# Altium project Labortápegység_v1.PrjPcb
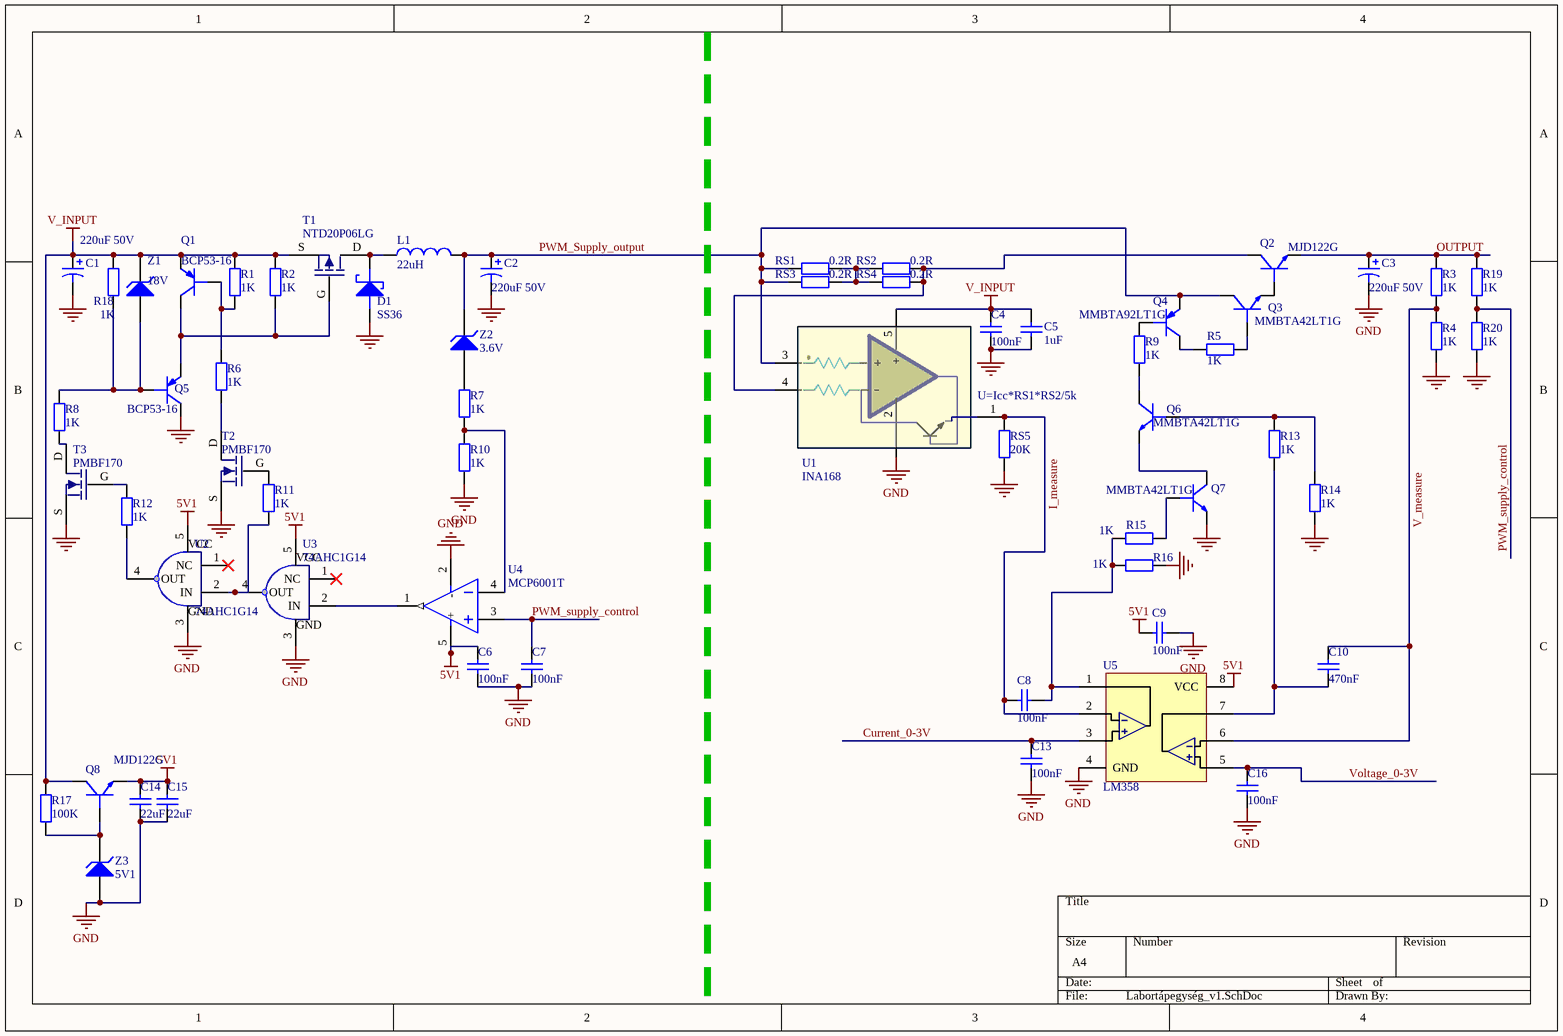
[diagram p0: Labortápegység_v1.SchDoc]
1 sheet, 60 parts. Net scope: global (net labels, ports and power ports of the same name join across sheets).
Board file: Labortápegység_v1.PcbDoc

## Sheet Labortápegység_v1.SchDoc
size A4; PageSetup: Record=PageOptions|CenterHorizontal=True|CenterVertical=True|PrintScale=0.96|XCorrection=1.00|YCorrection=1.00|PrintKind=2|BorderSize=5000000|LeftOffset=0|BottomOffset=0|Orientation=2|PaperLength=1000|PaperWidth=1000|Scale=100|PaperSource=7|PrintQuality=-4|MediaType=1|DitherType=10|PaperKind=A4|PrintScaleMode=1

### Parts
C1  220uF 50V  [CAP_ALU_ELKO_10D_10,5H]
C2  220uF 50V  [CAP_ALU_ELKO_10D_10,5H]
C3  220uF 50V  [CAP_ALU_ELKO_10D_10,5H]
C4  100nF  [FP_0603_CAP_080]
C5  1uF  [FP_0603_CAP_080]
C6  100nF  [FP_0603_CAP_080]
C7  100nF  [FP_0603_CAP_080]
C8  100nF  [FP_0603_CAP_080]
C9  100nF  [FP_0603_CAP_080]
C10  470nF  [FP_0603_CAP_080]
C13  100nF  [FP_0603_CAP_080]
C14  22uF  [FP_1210_CAP_N]
C15  22uF  [FP_1210_CAP_N]
C16  100nF  [FP_0603_CAP_080]
D1  SS36  [DIODE_SMC]
L1  22uH  [SRR1206_T]
Q1  BCP53-16  [TR_SOT223]
Q2  MJD122G  [TR_D-PAK]
Q3  MMBTA42LT1G  [TR_SOT23]
Q4  MMBTA92LT1G  [TR_SOT23]
Q5  BCP53-16  [TR_SOT223]
Q6  MMBTA42LT1G  [TR_SOT23]
Q7  MMBTA42LT1G  [TR_SOT23]
Q8  MJD122G  [TR_D-PAK]
R1  1K  [FP_0603_RES]
R2  1K  [FP_0603_RES]
R3  1K  [FP_0603_RES]
R4  1K  [FP_0603_RES]
R5  1K  [FP_0603_RES]
R6  1K  [FP_0603_RES]
R7  1K  [FP_0603_RES]
R8  1K  [FP_0603_RES]
R9  1K  [FP_0603_RES]
R10  1K  [FP_0603_RES]
R11  1K  [FP_0603_RES]
R12  1K  [FP_0603_RES]
R13  1K  [FP_0603_RES]
R14  1K  [FP_0603_RES]
R15  1K  [FP_0603_RES]
R16  1K  [FP_0603_RES]
R17  100K  [FP_0603_RES]
R18  1K  [FP_0603_RES]
R19  1K  [FP_0603_RES]
R20  1K  [FP_0603_RES]
RS1  0.2R  [FP_2512_RES]
RS2  0.2R  [FP_2512_RES]
RS3  0.2R  [FP_2512_RES]
RS4  0.2R  [FP_2512_RES]
RS5  20K  [FP_0603_RES]
T1  NTD20P06LG  [FET_D-PAK]
T2  PMBF170  [FET_SOT23]
T3  PMBF170  [FET_SOT23]
U1  INA168  [ANALOG_SOT23-5]
U2  74AHC1G14  [GATE_SOT23-5]
U3  74AHC1G14  [GATE_SOT23-5]
U4  MCP6001T  [ANALOG_SOT23-5]
U5  LM358  [FP_SO8_MS012AA]
Z1  18V  [SOD-80]
Z2  3.6V  [SOD-80]
Z3  5V1  [SOD-80]

### Nets
5V1: C6.2 C9.2 C14.2 C15.2 Q8.E U2.5(VCC) U3.5(VCC) U4.5(+) U5.8(VCC)
GND: C1.N C2.N C3.N C4.1 C5.2 C6.1 C7.1 C9.1 C13.1 C14.1 C15.1 C16.1 D1.A Q5.C Q7.E R4.2 R10.2 R14.2 R16.2 R20.2 RS5.2 T2.S T3.S U1.2(V-) U2.3(GND) U3.3(GND) U4.2(-) U5.4(GND) Z3.A
V_INPUT: C1.P C4.2 C5.1 Q1.E Q8.C R1.2 R2.2 R17.1 R18.2 T1.S U1.5(+) Z1.K
Current_0-3V: C13.2 U5.3
I_measure: C8.2 RS5.1 U1.1(out) U5.2
OUTPUT: C3.P Q2.E R3.1 R19.1
PWM_supply_control: C7.2 R19.2 R20.1 U4.3(IN1+)
PWM_Supply_output: C2.P L1.2 Q3.C Q4.E RS1.1 RS3.1 U1.3(+) Z2.K
V_measure: C10.2 R3.2 R4.1 U5.6
Voltage_0-3V: C16.2 U5.5
NetC8_1: C8.1 R15.2 R16.1 U5.1
NetC10_1: C10.1 R13.1 U5.7
NetD1_K: D1.K L1.1 T1.D
NetQ1_B: Q1.B R1.1 R6.1
NetQ1_C: Q1.C Q5.E R2.1 T1.G
NetQ2_B: Q2.B Q3.E
NetQ2_C: Q2.C RS2.2 RS4.2 U1.4(-)
NetQ3_B: Q3.B R5.2
NetQ4_B: Q4.B R9.2
NetQ4_C: Q4.C R5.1
NetQ5_B: Q5.B R8.1 R18.1 Z1.A
NetQ6_B: Q6.B R13.2 R14.1
NetQ6_C: Q6.C R9.1
NetQ6_E: Q6.E Q7.C
NetQ7_B: Q7.B R15.1
NetQ8_B: Q8.B R17.2 Z3.K
NetR6_2: R6.2 T2.D
NetR7_1: R7.1 Z2.A
NetR7_2: R7.2 R10.1 U4.4(IN1-)
NetR8_2: R8.2 T3.D
NetR11_1: R11.1 T2.G
NetR11_2: R11.2 U2.2(IN) U3.4(OUT)
NetR12_1: R12.1 T3.G
NetR12_2: R12.2 U2.4(OUT)
NetRS1_2: RS1.2 RS2.1 RS3.2 RS4.1
NetU3_2: U3.2(IN) U4.1(OUT1)

Not connected (* = marked no-connect by the designer): U1 8(NC); U2 1(NC)*; U3 1(NC)*

### Notes on the sheet
- (near U1) U=Icc*RS1*RS2/5k

### Library data of the parts
C1-C3 = Cap Pol1: Polarized Capacitor (Radial); Order info: ENDRICH: SUNCON 50CE200LX    VAGY    http://hu.mouser.com/ProductDetail/Panasonic/EEE-1HA221UAP/?qs=sGAEpiMZZMtZ1n0r9vR22YCGMi9egYVUqayaHvZYsZs%3d; Leírás: Capacitor electrolytic 220uF 50V 10x10.2; Value: 220uF 50V
C4 C6-C10 C13 C16 = Cap: Capacitor; Leírás: Capacitor ceramic X7R
  C4 C6-C9 C13 C16: Value: 100nF; Order info: 82-06-23
  C10: Value: 470nF; Order info: 82-06-04
C5 C14 C15 = CAP: Capacitor; Leírás: Capacitor ceramic X7R
  C5: Value: 1uF; Order info: 82-08-08
  C14 C15: Value: 22uF; Order info: http://hu.mouser.com/ProductDetail/Taiyo-Yuden/TMK325BJ226MM-T/?qs=sGAEpiMZZMs0AnBnWHyRQAEIN6r3SS%2fOXJMNV5oDxMA%3d
D1 = SCHOTTKY: NXP - PMEG3020EJ,115 - SCHOTTKY RECT 30V 2A SOD323F; Leírás: Diode 3A 60V DO-214AB SCH.RECT. SS36; Order info: 83-02-57
L1 = Inductor: Leírás: SRR1208-220ML; Value: 22uH; Order info: http://hu.mouser.com/ProductDetail/Bourns/SRR1208-220ML/?qs=%2fha2pyFadujgu6ZK%252bLLzvDgDstPyUY1M5VPhFWzAkvfuIk3rzvMn%2fw%3d%3d        VAGY    http://hu.mouser.com/ProductDetail/Bourns/SRR1206-220ML/?qs=%2fha2pyFaduit%252b29Yowv%252bGaK%2fP38%252bxCV%2fsQKhgBwEyVXSi%2fY9cCgS0A%3d%3d
Q1 Q4 Q5 = PNP: PNP General-purpose Transistor
  Q1 Q5: Order info: 86-04-75
  Q4: Order info: 86-00-50
Q2 Q3 Q6-Q8 = NPN: NPN General-purpose Transistor
  Q2 Q8: Order info: 86-01-08
  Q3 Q6 Q7: Order info: 86-00-32
R1-R16 R18-R20 = RES: Resistor; Value: 1K; Order info: 80-11-59; Leírás: Resistor
R17 RS1-RS5 = Res3: Resistor; Leírás: Resistor
  R17: Value: 100K; Order info: 80-11-40
  RS1-RS4: Value: 0.2R; Order info: http://hu.mouser.com/ProductDetail/Vishay/WSL2512R2000FTB/?qs=%2fha2pyFaduhOClWNbhuNIe4psoDiTKAZA5K%252bPtAoGZ8%3d
  RS5: Value: 20K; Order info: 81-14-96
T1 = PMOS: Order info: 86-01-58
T2 T3 = NMOS: Order info: Lomex 86-01-96; Leírás: N-FET 60V 0.2A
U2 U3 = 74AHC1G14: SCHMITT-TRIGGER INVERTER
U4 = MCP6001: Leírás: Operational Amplifiers - Op Amps Single 1.8V 1MHz,  rail-to-rail; Order info: http://hu.mouser.com/ProductDetail/Microchip/MCP6001T-I-OT/?qs=%2fha2pyFaduhMYk%252bs1pfzguPOcrwVNu3OEdqsO%2fGAmfqn6kTUaxRLyA%3d%3d
U5 = LM358: Low power dual operational amplifiers; Order info: 89-00-07
Z1-Z3 = ZENER: Zener Diode; Leírás: Zener Diode
  Z1: Order info: 85-00-16
  Z2: Order info: 85-00-76
  Z3: Order info: 85-00-15
U1 = INA168: Order info: http://hu.mouser.com/_/?Keyword=INA168NA%2F3K